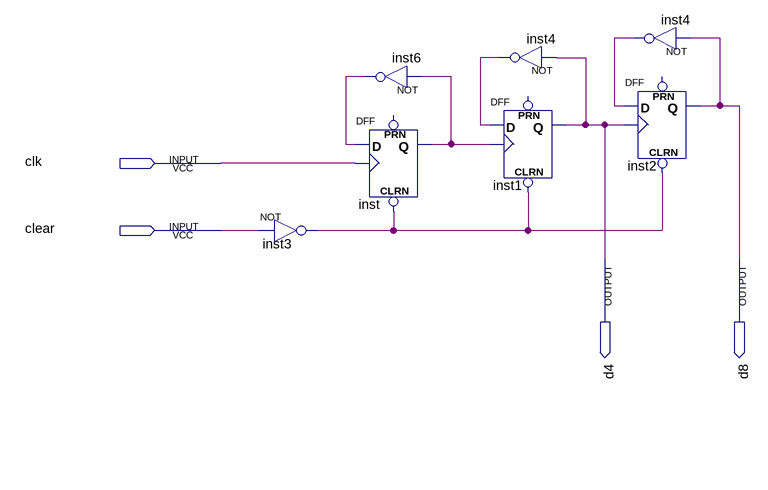
[diagram p0: schematic sheet]
// Quartus schematic rippledivider.bdf as structural Verilog: 7 symbols, 4 pins
module rippledivider (
  input  clk,
  input  clear,
  output d4,
  output d8
);

  wire inst3_out, inst4_out, inst4_out_2, inst6_out, inst_q;

  not inst3 (inst3_out, clear);
  not inst6 (inst6_out, inst_q);
  DFF inst (.CLRN(inst3_out), .CLK(clk), .D(inst6_out), .Q(inst_q));  // open: PRN
  not inst4 (inst4_out_2, d4);
  DFF inst1 (.CLRN(inst3_out), .CLK(inst_q), .D(inst4_out_2), .Q(d4));  // open: PRN
  not inst4_dup2 (inst4_out, d8);
  DFF inst2 (.CLRN(inst3_out), .CLK(d4), .D(inst4_out), .Q(d8));  // open: PRN
endmodule
